# EasyEDA Pro project ProPrj_通用工程PCB-Update-V3.1_2025-07-16.epro, schematic [SCH]Core_Board

## Sheets
1 P1: Board Name: Core_Board; Create Date: 2025-06-16; Page Name: P1; Project Name: 通用工程PCB-Update; Schematic Name: [SCH]Core_Board; Update Date: 2025-06-21; Company: Yuyu--; Page Size: A4; Version: V1.0
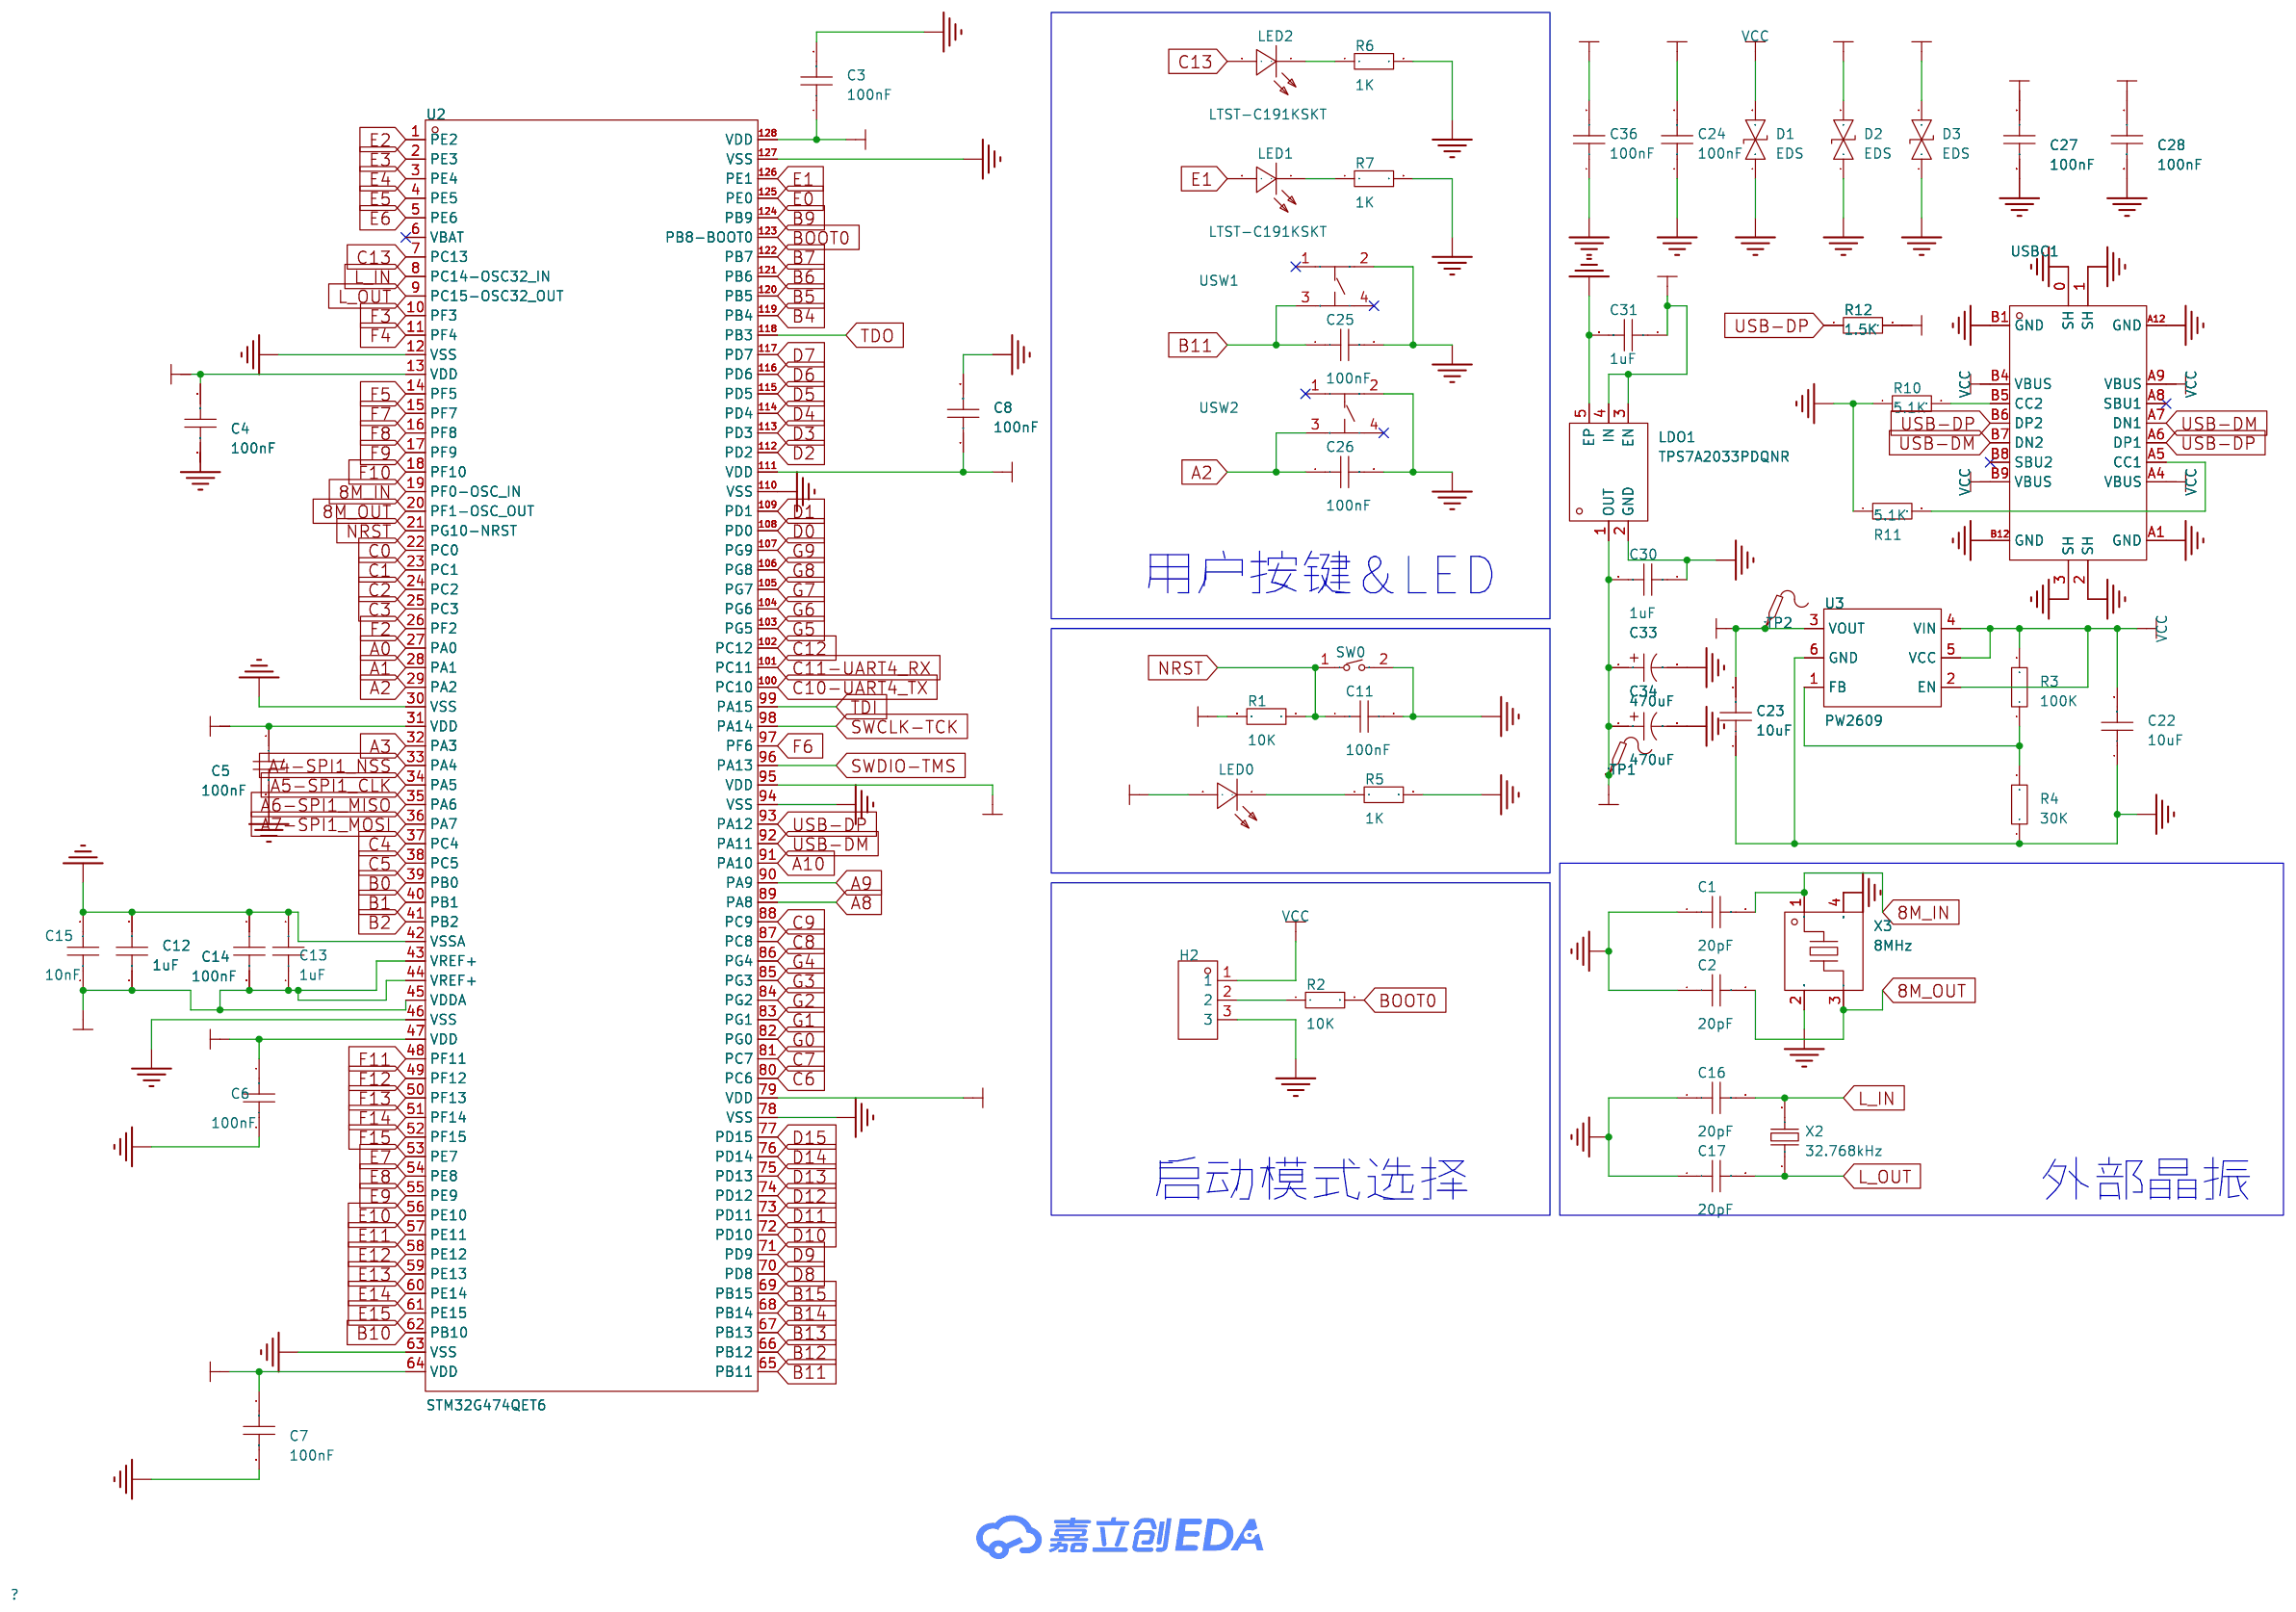
[diagram p0: P1]
2 P2: Board Name: Core_Borad; Page Name: P2; Schematic Name: [SCH]Core_Borad; Update Date: 2025-06-18; Company: 嘉立创EDA
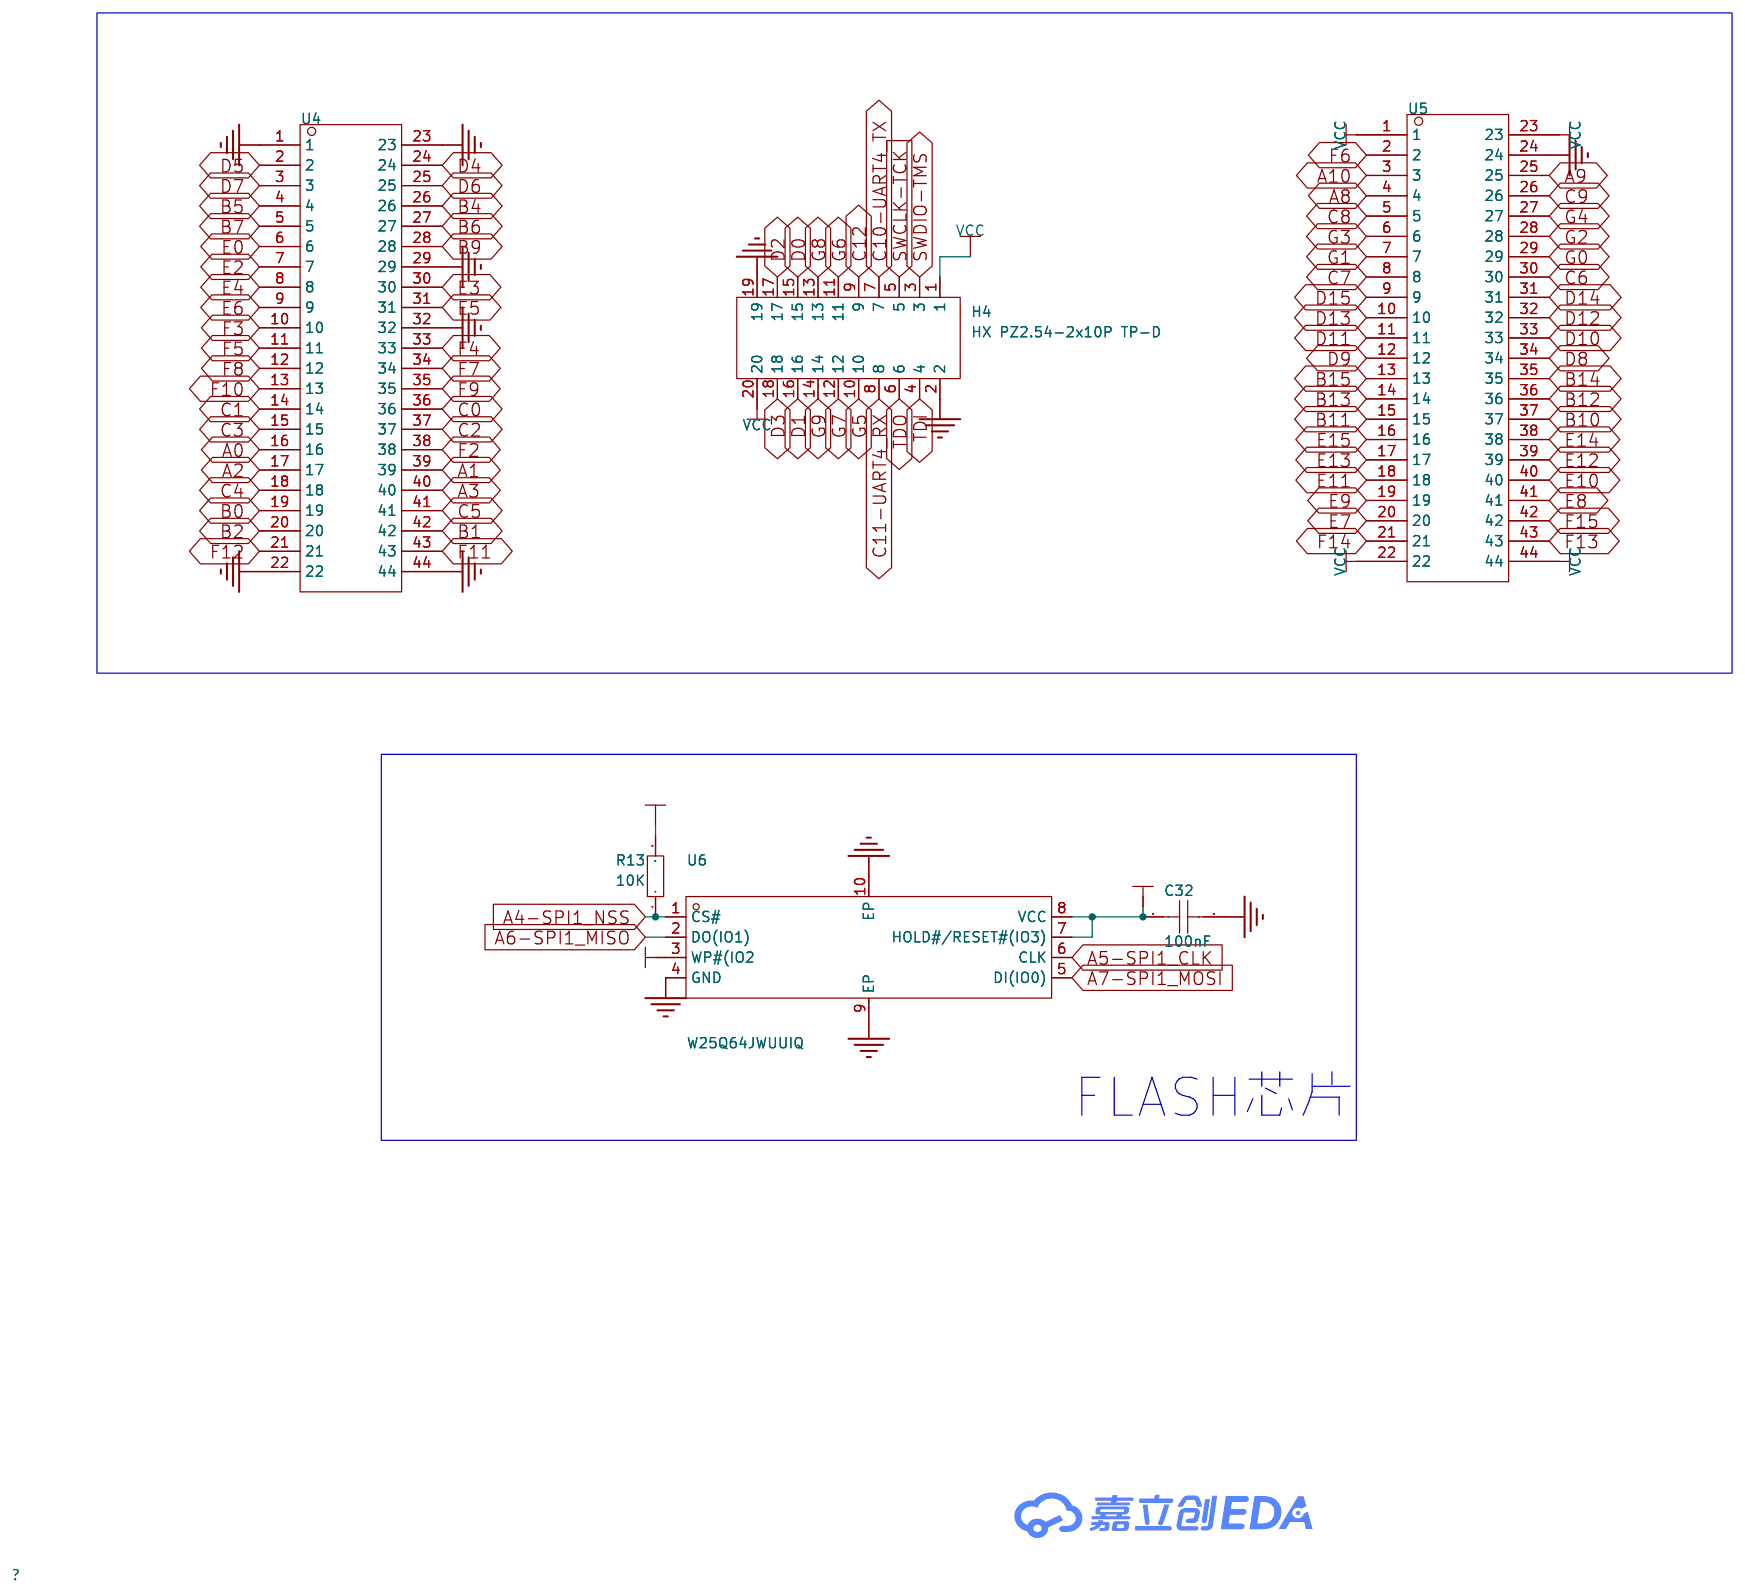
[diagram p1: P2]

## Parts
sheet P1
C1  20pF  [C0603]
C2  20pF  [C0603]
C3  100nF  [C0603]
C4  100nF  [C0603]
C5  100nF  [C0603]
C6  100nF  [C0603]
C7  100nF  [C0603]
C8  100nF  [C0603]
C11  100nF  [C0603]
C12  1uF  [C0603]
C13  1uF  [C0603]
C14  100nF  [C0603]
C15  10nF  [C0603]
C16  20pF  [C0603]
C17  20pF  [C0603]
C22  10uF  [C0603]
C23  10uF  [C0603]
C24  100nF  [C0603]
C25  100nF  [C0603]
C26  100nF  [C0603]
C27  100nF  [C0603]
C28  100nF  [C0603]
C30  1uF  [C0603]
C31  1uF  [C0603]
C33  470uF  [CAP-SMD_BD6.3-L6.6-W6.6-FD]
C34  470uF  [CAP-SMD_BD6.3-L6.6-W6.6-FD]
C36  100nF  [C0603]
D1  EDS  [SOD-523_L1.2-W0.8-LS1.6-BI]
D2  EDS  [SOD-523_L1.2-W0.8-LS1.6-BI]
D3  EDS  [SOD-523_L1.2-W0.8-LS1.6-BI]
H2  -  [HDR-TH_3P-P2.54-V-M]
LDO1  TPS7A2033PDQNR  [X2SON-4_L1.0-W1.0-P0.65-TL-EP]
LED0  LTST-C191KSKT  [LED0603-RD-YELLOW]
LED1  LTST-C191KSKT  [LED0603-RD-YELLOW]
LED2  LTST-C191KSKT  [LED0603-RD-YELLOW]
R1  10K  [R0603]
R2  10K  [R0603]
R3  100K  [R0603]
R4  30K  [R0603]
R5  1K  [R0603]
R6  1K  [R0603]
R7  1K  [R0603]
R10  5.1K  [R0603]
R11  5.1K  [R0603]
R12  1.5K  [R0603]
SW0  ZX-QC36-4.3TPWD  [KEY-SMD_L6.0-W3.5-LS8.0]
TP1  -  [Test-Point-0.5mm]
TP2  -  [Test-Point-0.5mm]
U2  STM32G474QET6  [LQFP-128_L14.0-W14.0-P0.40-LS16.0-BL]
U3  PW2609  [SOT-23-6_L2.9-W1.6-P0.95-LS2.8-BL]
USBC1  TYPE-C-31-M-12  [USB-C_SMD-TYPE-C-31-M-12]
USW1  KH-6X6X5H-STM  [SW-SMD_4P-L6.0-W6.0-P4.50-LS9.0_H5.0]
USW2  KH-6X6X5H-STM  [SW-SMD_4P-L6.0-W6.0-P4.50-LS9.0_H5.0]
X2  32.768kHz  [FC-135R_L3.2-W1.5]
X3  8MHz  [CRYSTAL-SMD_4P-L3.2-W2.5-BL]
sheet P2
C32  100nF  [C0603]
H4  HX PZ2.54-2x10P TP-D  [HDR-SMD_20P-P2.54-V-M-R2-C10-S2.54-LS7.5-EH]
R13  10K  [R0603]
U4  -  [贴片排针-定位柱 2x22p]
U5  -  [贴片排针-定位柱 2x22p]
U6  W25Q64JWUUIQ  [USON-8_L4.0-W3.0-P0.80-BL_WINBOND_UU]

## Library data of the parts
C1 C2 C16 C17 = CL10C200JB81PNC: 容值:20pF;精度:±5%;额定电压:50V;材质(温度系数):C0G;; LCSC Part Name: 20pF ±5% 50V; Supplier Part: C346210; Manufacturer: SAMSUNG(三星); Supplier Footprint: 0603; JLCPCB Part Class: 扩展库; Datasheet: https://atta.szlcsc.com/upload/public/pdf/source/20200508/C346214_8E91697E89AACDA228C00DCFD6338EB9.pdf; Supplier: LCSC; Tolerance: ±5%; Voltage Rated: 50V; Temperature Coefficient: C0G
C3-C8 C11 C14 C24-C28 C32 C36 = CC0603KRX7R9BB104: 容值:100nF;精度:±10%;额定电压:50V;温度系数:X7R;; LCSC Part Name: 100nF ±10% 50V; Supplier Part: C14663; Manufacturer: YAGEO(国巨); Supplier Footprint: 0603; JLCPCB Part Class: Basic Part; Datasheet: https://atta.szlcsc.com/upload/public/pdf/source/20180910/C282072_33301C7F631E79921B82A8DAC6BCC5B3.pdf; Supplier: LCSC; Tolerance: ±10%; Voltage Rating: 50V; Temperature Coefficient: X7R
C12 C13 = CGJ3E3X7R1C105K080AB: 容值:1uF;精度:±10%;额定电压:16V;材质(温度系数):X7R;; LCSC Part Name: 1uF ±10% 16V; Supplier Part: C3872984; Manufacturer: TDK; Supplier Footprint: 0603; JLCPCB Part Class: 扩展库; Datasheet: https://atta.szlcsc.com/upload/public/pdf/source/231023/files-19dba70df95f1e579ee79f9957c4f5cc.pdf; Supplier: LCSC; Tolerance: ±10%; Voltage Rated: 16V; Temperature Coefficient: X7R
C15 = CL10B103KB8WPNC: 容值:10nF;精度:±10%;额定电压:50V;材质(温度系数):X7R;; LCSC Part Name: 10nF ±10% 50V; Supplier Part: C307346; Manufacturer: SAMSUNG(三星); Supplier Footprint: 0603; JLCPCB Part Class: 扩展库; Datasheet: https://atta.szlcsc.com/upload/public/pdf/source/20160218/1457707763339.pdf; Supplier: LCSC; Tolerance: ±10%; Voltage Rated: 50V; Temperature Coefficient: X7R
C22 C23 C30 C31 = CAP_0603: Supplier Footprint: 0603
C33 C34 = GVT1A477M0608CNVC: 容值:470uF;精度:±20%;额定电压:10V;纹波电流:150mA@120Hz;; LCSC Part Name: 470uF ±20% 10V; Supplier Part: C2983309; Manufacturer: HRK(鸿瑞凯电子); Supplier Footprint: SMD,D6.3xL7.7mm; JLCPCB Part Class: 扩展库; Datasheet: https://atta.szlcsc.com/upload/public/pdf/source/20220321/3A4A82F9B7B0C8C257CAAADB11D703EA.pdf; Supplier: LCSC; Tolerance: ±20%; Rated Voltage: 10V; Ripple Current: 150mA@120Hz; φD: 6.3mm; L: 8mm; Lifetime @ Temp: 3000hrs@105℃; Operating Temperature: -55℃~+105℃
D1-D3 = LESD5Z5.0CT1G: 极性:双向;反向截止电压(Vrwm):5V;最大钳位电压:18.6V;峰值脉冲电流(Ipp):9.4A;击穿电压:5.6V;; LCSC Part Name: 双向ESD; Supplier Part: C136167; Manufacturer: LRC(乐山无线电); Supplier Footprint: SOD-523; JLCPCB Part Class: 扩展库; Datasheet: https://atta.szlcsc.com/upload/public/pdf/source/20171026/C136167_15089841930291059137.pdf; Supplier: LCSC; polarity: 双向; Reverse Stand-Off Voltage (Vrwm): 5V; Maximum Clamping Voltage: 18.6V; Peak Pulse Current (Ipp): 9.4A; Breakdown Voltage: 5.6V; Type: ESD
H2 = HDR-M_2.54_1x3P: Supplier Part: C2937625; Supplier Footprint: 插件
LDO1 = TPS7A2033PDQNR: 输出类型:固定;最大输入电压:6V;输出电压:3.3V;输出电流:300mA;输出极性:正极;; LCSC Part Name: 具有高 PSRR 的 300mA、超低噪声、低 IQ、低压降 (LDO) 线性稳压器; Supplier Part: C2871641; Manufacturer: TI(德州仪器); Supplier Footprint: SON-4(1x1); JLCPCB Part Class: 扩展库; Datasheet: https://www.ti.com/cn/lit/gpn/tps7a20; Supplier: LCSC; Output Type: 固定; Maximum Input Voltage: 6V; Output Voltage: 3.3V; Output Current: 300mA; Dropout Voltage: 140mV@(300mA); standby current: 15uA; Feature: 防静电保护；软启动；浪涌保护；低ESR；热保护(TSD)；欠压闭锁；过流保护(OCP)；带使能；防倒灌; Operating Temperature: -40℃~+125℃@(Tj); Output Polarity: 正极; Number of Outputs: 1
LED0-LED2 = LTST-C191KSKT: 发光颜色:黄色;正向电压(VF):2.1V;功率:75mW;正向电流:20mA;主波长:584.5nm~597nm;二极管配置:-;透镜颜色:无色透明透镜;色温:-;发光强度:104mcd;发光角度:130°;载带方式:-;工作温度:-55℃~+85℃;; LCSC Part Name: 黄灯; Supplier Part: C125100; Manufacturer: LITEON(光宝); Supplier Footprint: 0603; JLCPCB Part Class: 扩展库; Datasheet: https://atta.szlcsc.com/upload/public/pdf/source/20180129/C125100_15171877314981315871.pdf; Supplier: LCSC; Emitted Color: 黄色; Forward Voltage (VF): 2.1V; Power Dissipation: 75mW; Forward Current: 20mA; Dominant Wavelength: 584.5nm~597nm; Peak Wavelength: 588nm; Lens Color: 无色透明透镜; Luminous Intensity: 104mcd; Viewing Angle: 130°; Operating Temperature: -55℃~+85℃
R1-R7 R10-R13 = Res_0603: Supplier Footprint: 0603
SW0 = ZX-QC36-4.3TPWD: 电路结构:单刀单掷;按钮形状:矩形按钮;作用力:2.6N;安装方式:立贴;开关长度:3mm;开关宽度:6mm;开关高度:4.3mm;带支架:不带支架;触点电流:50mA;额定电压:12V;机械寿命:10万次;; LCSC Part Name: 3*6*4.3贴片开关无定位; Supplier Part: C7470221; Manufacturer: Megastar(兆星); Supplier Footprint: SMD; JLCPCB Part Class: 扩展库; Datasheet: https://atta.szlcsc.com/upload/public/pdf/source/20230724/9B602E3A6629F513690F56C9FD4C5817.pdf; Supplier: LCSC; Circuit: 单刀单掷; Actuator Style: 矩形按钮; Operating Force: 2.6N; Mounting Style: 立贴; Switch Length: 3mm; Switch Width: 6mm; Switch Height: 4.3mm; Strike Gundam: 不带支架; Contact Current: 50mA; Voltage Rating: 12V; Actuator/Cap Color: 白色; Pin Style: 鸥翼型; Mechanical Life: 10万次; Operating Temperature: -30℃~+80℃
TP1 TP2 = Test-Point: Test Point 测试点
U2 = STM32G474QET6: CPU内核:ARM-M系列;CPU最大主频:170MHz;应用领域:-;; LCSC Part Name: 带DSP和FPU的170MHz主流ARM Cortex-M4 MCU，具有512 KB Flash存储器、数学加速器、高分辨率定时器和高模拟电平集成; Supplier Part: C730129; Manufacturer: ST(意法半导体); Supplier Footprint: LQFP-128(14x14); JLCPCB Part Class: Extended Part; Datasheet: https://atta.szlcsc.com/upload/public/pdf/source/20200902/C431632_38212262685EE30B1989689374F08940.pdf; Supplier: LCSC; CPU Core: ARM-M系列; CPU Maximum Speed: 170MHz; Program Storage Size: 512KB; Program Memory Type: FLASH; Number of I/O: 107; ADC (Bit): 12bit; DAC (Bit): 12bit; Voltage - Supply: 1.71V~3.6V
U3 = PW2609: Supplier Part: C9900022406; Supplier Footprint: SOT-23-6; JLCPCB Part Class: 扩展库; Supplier: LCSC
USBC1 = TYPE-C-31-M-12: 连接器类型:Type-C;标准:-;公母:母;安装方式:-;触点数量:16P;端口数量:1;额定电流 - 电源:5A;工作温度范围:-;; LCSC Part Name: Type-C 母; Supplier Part: C165948; Manufacturer: 韩国韩荣; Supplier Footprint: SMD; JLCPCB Part Class: 扩展库; Datasheet: https://atta.szlcsc.com/upload/public/pdf/source/20220525/466408E853115E789EDB0DDC29077C05.pdf; Supplier: LCSC; Connector Type: Type-C; Gender: 母; Number of Contacts: 16P; Number of Ports: 1; Current Rating - Power (Max): 5A
USW1 USW2 = KH-6X6X5H-STM: 电路结构:单刀单掷;按钮形状:圆形按钮;安装方式:立贴;开关长度:6mm;开关宽度:6mm;开关高度:5mm;带支架:不带;触点电流:50mA;额定电压(DC):12V;机械寿命:8万次;; LCSC Part Name: 6*6*5mm 立贴 轻触开关; Supplier Part: C2837531; Manufacturer: kinghelm(金航标); Supplier Footprint: SMD; JLCPCB Part Class: 扩展库; Datasheet: https://atta.szlcsc.com/upload/public/pdf/source/20210608/C2837531_45E87AB996CE723B09405FF2EA209C4C.pdf; Supplier: LCSC; Circuit: 单刀单掷; Actuator Style: 圆形按钮; Mounting Style: 立贴; Switch Length: 6mm; Switch Width: 6mm; Switch Height: 5mm; Strike Gundam: 不带; Contact Current: 50mA; Voltage Rating (DC): 12V; Actuator/Cap Color: 黑色; Pin Style: 鸥翼型; Mechanical Life: 8万次
X2 = Q13FC13500004_C32346: 晶振类型:贴片晶振;频率:32.768kHz;常温频差:±20ppm;负载电容:12.5pF;; LCSC Part Name: 32.768kHz ±20ppm 12.5pF; Supplier Part: C32346; Manufacturer: EPSON(爱普生); Manufacturer Part: Q13FC13500004; Supplier Footprint: SMD3215-2P; JLCPCB Part Class: 基础库; Datasheet: https://atta.szlcsc.com/upload/public/pdf/source/20240418/0E0FF5F0356BA3753F616001439D1416.pdf; Supplier: LCSC; Crystal Type: 贴片晶振; Normal temperature Frequency Tolerance: ±20ppm; Load Capacitor: 12.5pF; Equivalent Series Resistance (ESR): 70kΩ; Operating Temperature: -40℃~+85℃
X3 = X32258MSB4SI: 晶振类型:贴片晶振;频率:8MHz;常温频差:±10ppm;负载电容:20pF;频率稳定度:±20ppm;; LCSC Part Name: 8MHz ±10ppm 20pF; Supplier Part: C2682774; Manufacturer: YXC(扬兴晶振); Supplier Footprint: SMD3225-4P; JLCPCB Part Class: 扩展库; Datasheet: https://atta.szlcsc.com/upload/public/pdf/source/20240329/19D5F850207469550BEB00D7DFEDBC7A.pdf; Supplier: LCSC; Type: 贴片晶振; Normal temperature Frequency Tolerance: ±10ppm; Load Capacitance: 20pF; Frequency Stability: ±20ppm; Operating Temperature: -40℃~+85℃
H4 = HX PZ2.54-2x10P TP-D: 双排贴片带柱子  配套排母HX PM2.54-2x10P系列; LCSC Part Name: 配套排母HX PM2.54-2x10P系列 2.54-2*10P立式贴片公头 带定位柱; Supplier Part: C46061674; Manufacturer: hanxia(韩下); Supplier Footprint: SMD,P=2.54mm; Datasheet: https://atta.szlcsc.com/upload/public/pdf/source/20250227/CD8A4921DA8D0A5116E42F42C120EF99.pdf; Supplier: LCSC
U4 U5 = 贴片排针-定位柱 2x22p
U6 = W25Q64JWUUIQ: 接口类型:SPI;存储容量:64Mbit;; Supplier Part: C6604692; Manufacturer: WINBOND(华邦); Supplier Footprint: USON-8(3x4); JLCPCB Part Class: 扩展库; Datasheet: https://atta.szlcsc.com/upload/public/pdf/source/20210420/C2595075_E7A7725B7CF2DE50C07916BF10CAF3A1.pdf; Supplier: LCSC; Interface Type: SPI; Memory Size: 64Mbit; Supply Voltage: 1.7V~1.95V; Page Programming Time (Tpp): 3ms; Operating Temperature: -40℃~+85℃

## Nets
3V3: C3.1 C4.1 C5.1 C6.1 C7.1 C8.1 C12.1 C13.1 C14.2 C15.1 C24.2 C30.2 C32.1 C33.1 C34.1 C36.2 D2.2 LDO1.1(OUT) LED0.2(+) R1.2 R12.2 R13.2 TP1.1 U2.13(VDD) U2.31(VDD) U2.43(VREF+) U2.44(VREF+) U2.45(VDDA) U2.47(VDD) U2.64(VDD) U2.79(VDD) U2.95(VDD) U2.111(VDD) U2.128(VDD) U6.3(WP#(IO2) U6.7(HOLD#/RESET#(IO3)) U6.8(VCC)
5V: C23.2 C27.1 C28.1 C31.1 D3.2 LDO1.3(EN) LDO1.4(IN) TP2.1 U3.3(VOUT)
GND: C1.1 C2.1 C3.2 C4.2 C5.2 C6.2 C7.2 C8.2 C11.2 C12.2 C13.2 C14.1 C15.2 C16.1 C17.1 C22.1 C23.1 C24.1 C25.2 C26.2 C27.2 C28.2 C30.1 C31.2 C32.2 C33.2 C34.2 C36.1 D1.1 D2.1 D3.1 H2.3 H4.2 H4.19 LDO1.2(GND) LDO1.5(EP) R4.1 R5.2 R6.2 R7.2 R10.1 R11.1 SW0.2 U2.12(VSS) U2.30(VSS) U2.42(VSSA) U2.46(VSS) U2.63(VSS) U2.78(VSS) U2.94(VSS) U2.110(VSS) U2.127(VSS) U3.6(GND) U4.1 U4.22 U4.23 U4.29 U4.32 U4.44 U5.24 U6.4(GND) U6.9(EP) U6.10(EP) USBC1.0(SH) USBC1.1(SH) USBC1.2(SH) USBC1.3(SH) USBC1.A1(GND) USBC1.A12(GND) USBC1.B1(GND) USBC1.B12(GND) USW1.2 USW2.2 X3.2(GND) X3.4(GND)
VCC: C22.2 D1.2 H2.1 H4.1 H4.20 R3.2 U3.2(EN) U3.4(VIN) U3.5(VCC) U5.1 U5.22 U5.23 U5.44 USBC1.A4(VBUS) USBC1.A9(VBUS) USBC1.B4(VBUS) USBC1.B9(VBUS)
8M_IN: C1.2 U2.19(PF0-OSC_IN) X3.1
8M_OUT: C2.2 U2.20(PF1-OSC_OUT) X3.3
A0: U2.27(PA0) U4.16
A1: U2.28(PA1) U4.39
A2: C26.1 U2.29(PA2) U4.17 USW2.3
A3: U2.32(PA3) U4.40
A4-SPI1_NSS: R13.1 U2.33(PA4) U6.1(CS#)
A5-SPI1_CLK: U2.34(PA5) U6.6(CLK)
A6-SPI1_MISO: U2.35(PA6) U6.2(DO(IO1))
A7-SPI1_MOSI: U2.36(PA7) U6.5(DI(IO0))
A8: U2.89(PA8) U5.4
A9: U2.90(PA9) U5.25
A10: U2.91(PA10) U5.3
B0: U2.39(PB0) U4.19
B1: U2.40(PB1) U4.42
B2: U2.41(PB2) U4.20
B4: U2.119(PB4) U4.26
B5: U2.120(PB5) U4.4
B6: U2.121(PB6) U4.27
B7: U2.122(PB7) U4.5
B9: U2.124(PB9) U4.28
B10: U2.62(PB10) U5.37
B11: C25.1 U2.65(PB11) U5.15 USW1.3
B12: U2.66(PB12) U5.36
B13: U2.67(PB13) U5.14
B14: U2.68(PB14) U5.35
B15: U2.69(PB15) U5.13
BOOT0: R2.2 U2.123(PB8-BOOT0)
C0: U2.22(PC0) U4.36
C1: U2.23(PC1) U4.14
C2: U2.24(PC2) U4.37
C3: U2.25(PC3) U4.15
C4: U2.37(PC4) U4.18
C5: U2.38(PC5) U4.41
C6: U2.80(PC6) U5.30
C7: U2.81(PC7) U5.8
C8: U2.87(PC8) U5.5
C9: U2.88(PC9) U5.26
C10-UART4_TX: H4.7 U2.100(PC10)
C11-UART4_RX: H4.8 U2.101(PC11)
C12: H4.9 U2.102(PC12)
C13: LED2.2(+) U2.7(PC13)
D0: H4.15 U2.108(PD0)
D1: H4.16 U2.109(PD1)
D2: H4.17 U2.112(PD2)
D3: H4.18 U2.113(PD3)
D4: U2.114(PD4) U4.24
D5: U2.115(PD5) U4.2
D6: U2.116(PD6) U4.25
D7: U2.117(PD7) U4.3
D8: U2.70(PD8) U5.34
D9: U2.71(PD9) U5.12
D10: U2.72(PD10) U5.33
D11: U2.73(PD11) U5.11
D12: U2.74(PD12) U5.32
D13: U2.75(PD13) U5.10
D14: U2.76(PD14) U5.31
D15: U2.77(PD15) U5.9
E0: U2.125(PE0) U4.6
E1: LED1.2(+) U2.126(PE1)
E2: U2.1(PE2) U4.7
E3: U2.2(PE3) U4.30
E4: U2.3(PE4) U4.8
E5: U2.4(PE5) U4.31
E6: U2.5(PE6) U4.9
E7: U2.53(PE7) U5.20
E8: U2.54(PE8) U5.41
E9: U2.55(PE9) U5.19
E10: U2.56(PE10) U5.40
E11: U2.57(PE11) U5.18
E12: U2.58(PE12) U5.39
E13: U2.59(PE13) U5.17
E14: U2.60(PE14) U5.38
E15: U2.61(PE15) U5.16
F2: U2.26(PF2) U4.38
F3: U2.10(PF3) U4.10
F4: U2.11(PF4) U4.33
F5: U2.14(PF5) U4.11
F6: U2.97(PF6) U5.2
F7: U2.15(PF7) U4.34
F8: U2.16(PF8) U4.12
F9: U2.17(PF9) U4.35
F10: U2.18(PF10) U4.13
F11: U2.48(PF11) U4.43
F12: U2.49(PF12) U4.21
F13: U2.50(PF13) U5.43
F14: U2.51(PF14) U5.21
F15: U2.52(PF15) U5.42
G0: U2.82(PG0) U5.29
G1: U2.83(PG1) U5.7
G2: U2.84(PG2) U5.28
G3: U2.85(PG3) U5.6
G4: U2.86(PG4) U5.27
G5: H4.10 U2.103(PG5)
G6: H4.11 U2.104(PG6)
G7: H4.12 U2.105(PG7)
G8: H4.13 U2.106(PG8)
G9: H4.14 U2.107(PG9)
L_IN: C16.2 U2.8(PC14-OSC32_IN) X2.2
L_OUT: C17.2 U2.9(PC15-OSC32_OUT) X2.1
NRST: C11.1 R1.1 SW0.1 U2.21(PG10-NRST)
SWCLK-TCK: H4.5 U2.98(PA14)
SWDIO-TMS: H4.3 U2.96(PA13)
TDI: H4.4 U2.99(PA15)
TDO: H4.6 U2.118(PB3)
USB-DM: U2.92(PA11) USBC1.A7(DN1) USBC1.B7(DN2)
USB-DP: R12.1 U2.93(PA12) USBC1.A6(DP1) USBC1.B6(DP2)
$1N4520: H2.2 R2.1
$1N4873: LED1.1(-) R7.1
$1N4875: LED2.1(-) R6.1
$1N5105: LED0.1(-) R5.1
$1N6493: R10.2 USBC1.B5(CC2)
$1N6557: R11.2 USBC1.A5(CC1)
$1N6882: R3.1 R4.2 U3.1(FB)

Not connected (* = marked no-connect by the designer): U2 6(VBAT)*; USBC1 A8(SBU1)* B8(SBU2)*; USW1 1* 4*; USW2 1* 4*

## Notes on the sheets
sheet 1
- 用户按键&LED
- 启动模式选择
- 外部晶振
sheet 2
- FLASH芯片
